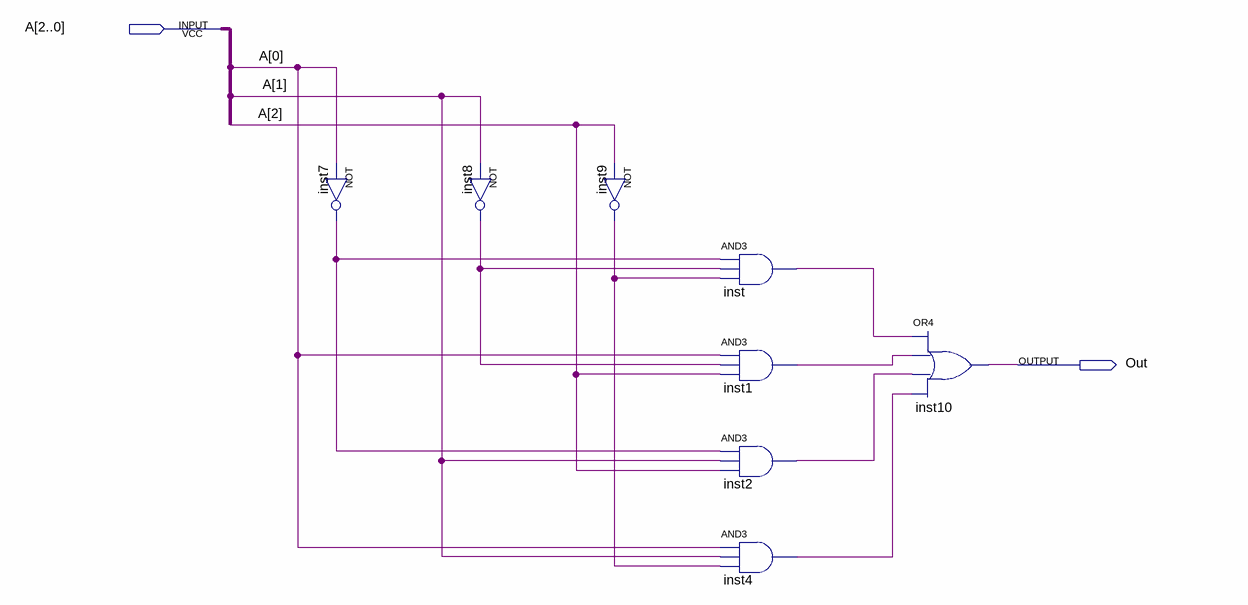
[diagram p0: schematic sheet]
// Quartus schematic odd_parity.bdf as structural Verilog: 8 symbols, 2 pins
module odd_parity (
  input  [2:0] A,
  output Out
);

  wire inst1_out, inst2_out, inst4_out, inst7_out, inst8_out, inst9_out, inst_out;

  not inst7 (inst7_out, A[0]);
  not inst8 (inst8_out, A[1]);
  not inst9 (inst9_out, A[2]);
  and inst (inst_out, inst7_out, inst8_out, inst9_out);
  and inst1 (inst1_out, A[0], inst8_out, A[2]);
  and inst2 (inst2_out, inst7_out, A[1], A[2]);
  and inst4 (inst4_out, A[0], A[1], inst9_out);
  or inst10 (Out, inst_out, inst1_out, inst2_out, inst4_out);
endmodule
